# Altium schematic sheet GPS.SchDoc
size A4
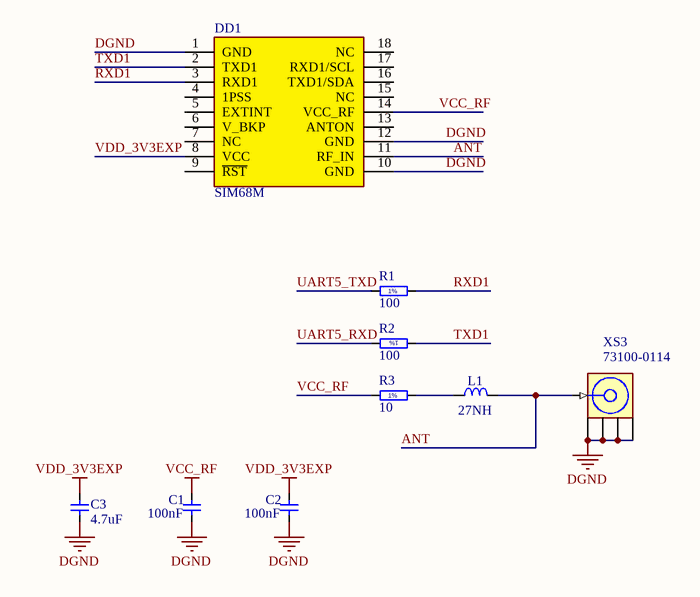
[diagram p0: GPS.SchDoc]

## Parts
C1  100nF  [CAP0603R]
C2  100nF  [CAP0603R]
C3  4.7uF  [CAP0603R]
DD1  SIM68M  [SIM68M]
L1  27NH  [INDC1608X75N]
R1  100  [RES0603R]
R2  100  [RES0603R]
R3  10  [RES0603R]
XS3  73100-0114  [73100-0114]

## Nets
DGND: C1.2 C2.2 C3.1 DD1.1(GND) DD1.10(GND) DD1.12(GND) XS3.2(GND) XS3.3(GND) XS3.4(GND) XS3.5(GND)
VCC_RF: C1.1 DD1.14(VCC_RF) R3.1
VDD_3V3EXP: C2.1 C3.2 DD1.8(VCC)
ANT: DD1.11(RF_IN) L1.2 XS3.1(Signal)
RXD1: DD1.3(RXD1) R1.2
TXD1: DD1.2(TXD1) R2.1
UART5_RXD: R2.2
UART5_TXD: R1.1
NetL1_1: L1.1 R3.2

Not connected (* = marked no-connect by the designer): DD1 4(1PSS) 5(EXTINT) 6(V_BKP) 7(NC) 9(~{RST}) 13(ANTON) 15(NC) 16(TXD1/SDA) 17(RXD1/SCL) 18(NC)

## Notes on the sheet
- (in symbol R0603_10R_1%_0.1W_200PPM) 1%
- (in symbol R0603_100R_1%_0.1W_100PPM) 1%

## Library data of the parts
C1 C2 = CC0603_100NF_50V_10%_X7R: SMD 0805 Capacitor; Part Description: SMD Multilayer Chip Ceramic Capacitor; Manufacturer: GENERIC; Manufacturer1 Part Number: 223858615649; Voltage: 50V; TC: X7R; Tolerance: ±10%; Table: Capacitors SMD; Part Number: CC0603_100NF_50V_10%_X7R; Component Kind: Standard; Component Type: Standard; Pin Count: 2; Value: 100nF; Status: Preferred; Manufacturer Part Number: CC0603_100NF_50V_10%_X7R; Case: 0603; Mounted: Yes; Socket: No; SMD: Yes; Manufacturer1 Example: PHYCOMP; Manufacturer1 ComponentHeight: 0.87mm; HelpURL: \\cern.ch\dfs\Applications\Altium\Datasheets\CC0603_X7R_PHYCOMP.pdf; Author: I. Kuznetsov; CreateDate: 03.12.2007; LatestRevisionDate: 03.12.2007
C3 = CC0603_4.7UF_6.3V_10%_X5R: SMD 0805 Capacitor; Part Description: SMD Multilayer Chip Ceramic Capacitor; Manufacturer: GENERIC; Manufacturer1 Part Number: 225520613672; Voltage: 6.3V; TC: X5R; Tolerance: ±10%; Table: Capacitors SMD; Part Number: CC0603_4.7UF_6.3V_10%_X5R; Component Kind: Standard; Component Type: Standard; Pin Count: 2; Value: 4.7uF; Status: Preferred; Manufacturer Part Number: CC0603_4.7uF_6.3V_10%_X5R; Case: 0603; Mounted: Yes; Socket: No; SMD: Yes; Manufacturer1 Example: PHYCOMP; Manufacturer1 ComponentHeight: 0.87mm; HelpURL: \\cern.ch\dfs\Applications\Altium\Datasheets\CC0805_X5R_PHYCOMP_HC.pdf; Author: I. Kuznetsov; CreateDate: 03.12.2007; LatestRevisionDate: 03.12.2007
DD1 = SIM68M: Table: Analog and Interface; Part Number: SIM68M; Component Kind: Standard; Component Type: Standard; Device: SIM68M; PackageDescription: SIM68M; Status: Active; Manufacturer Part Number: SIM68M; Pin Count: 18; Case: SIM68M; Author: I. Kuznetsov
L1 = IND0603_TDK_MMZ1608B601C: Inductor; Part Description: SMT Chip Bead for Signal Line; Manufacturer: TDK; Value: 600R@100MHz; Power: 500mA; Resistance: 0.4R; Tolerance: ±25%; Table: Inductors SMD; Part Number: IND0603_TDK_MMZ1608B601C; Component Kind: Standard; Component Type: Standard; Pin Count: 2; Status: None; Manufacturer Part Number: MMZ1608B601C; Case: 0603; Mounted: Yes; Socket: No; SMD: Yes; ComponentHeight: 0.75mm; HelpURL: \\cern.ch\dfs\Applications\Altium\Datasheets\IND0603_TDK_MMZ1608.pdf; Author: CERN DEM JMW; CreateDate: 21.04.2009; LatestRevisionDate: 02.12.2009
R1 R2 = R0603_100R_1%_0.1W_100PPM: Part Description: General Purpose Thick Film Chip Resistor; Manufacturer: GENERIC; Manufacturer1 Part Number: NRC06F4700TRF; Power: 0.1W; TC: ±100ppm/°C; Tolerance: ±1%; Table: Resistors SMD; Part Number: R0603_100R_1%_0.1W_100PPM; Component Kind: Standard; Component Type: Standard; Footprint: RESC1608X55N; Pin Count: 2; Value: 100; Status: Preferred; Manufacturer Part Number: R0603_100R_1%_0.1W_100PPM; Case: 0603; Mounted: Yes; Socket: No; SMD: Yes; Manufacturer1 Example: NIC COMPONENT; Manufacturer1 ComponentHeight: 0.55mm; HelpURL: \\cern.ch\dfs\Applications\Altium\Datasheets\R0603_NIC_NRC.pdf; Author: CERN DEM JLC; CreateDate: 03.12.2007; LatestRevisionDate: 13.03.2008
R3 = R0603_10R_1%_0.1W_200PPM: Part Description: General Purpose Thick Film Chip Resistor; Manufacturer: GENERIC; Manufacturer1 Part Number: NRC06F10R0TRF; Power: 0.1W; TC: ±200ppm/°C; Tolerance: ±1%; Table: Resistors SMD; Part Number: R0603_10R_1%_0.1W_200PPM; Component Kind: Standard; Component Type: Standard; Footprint: RESC1608X55N; Pin Count: 2; Value: 10; Status: Preferred; Manufacturer Part Number: R0603_10R_1%_0.1W_200PPM; Case: 0603; Mounted: Yes; Socket: No; SMD: Yes; Manufacturer1 Example: NIC COMPONENT; Manufacturer1 ComponentHeight: 0.55mm; HelpURL: \\cern.ch\dfs\Applications\Altium\Datasheets\R0603_NIC_NRC.pdf; Author: CERN DEM JLC; CreateDate: 03.12.2007; LatestRevisionDate: 24.06.2009
XS3 = 73100-0114: RF Coaxial PCB Connector, MCX; Thru-Hole, Right-Angle Mount Socket, Blunt Post Terminal, 50 Ohm Impedance; Part Description: Connector; RF Coaxial, MCX, Thru-Hole; 5 Position; Right-Angle; Manufacturer: MOLEX; Part Number: 73100-0114; Component Kind: Standard; Component Type: Standard; PackageDescription: 73100-0114; Pin Count: 5; Family: SMA; Device: 73100-0114; Manufacturer Part Number: 73100-0114; ComponentLink1URL: http://www.molex.com/pdm_docs/sd/731000114_sd.pdf; Table: MOLEX